# Altium schematic sheet cont_board.SchDoc
size A
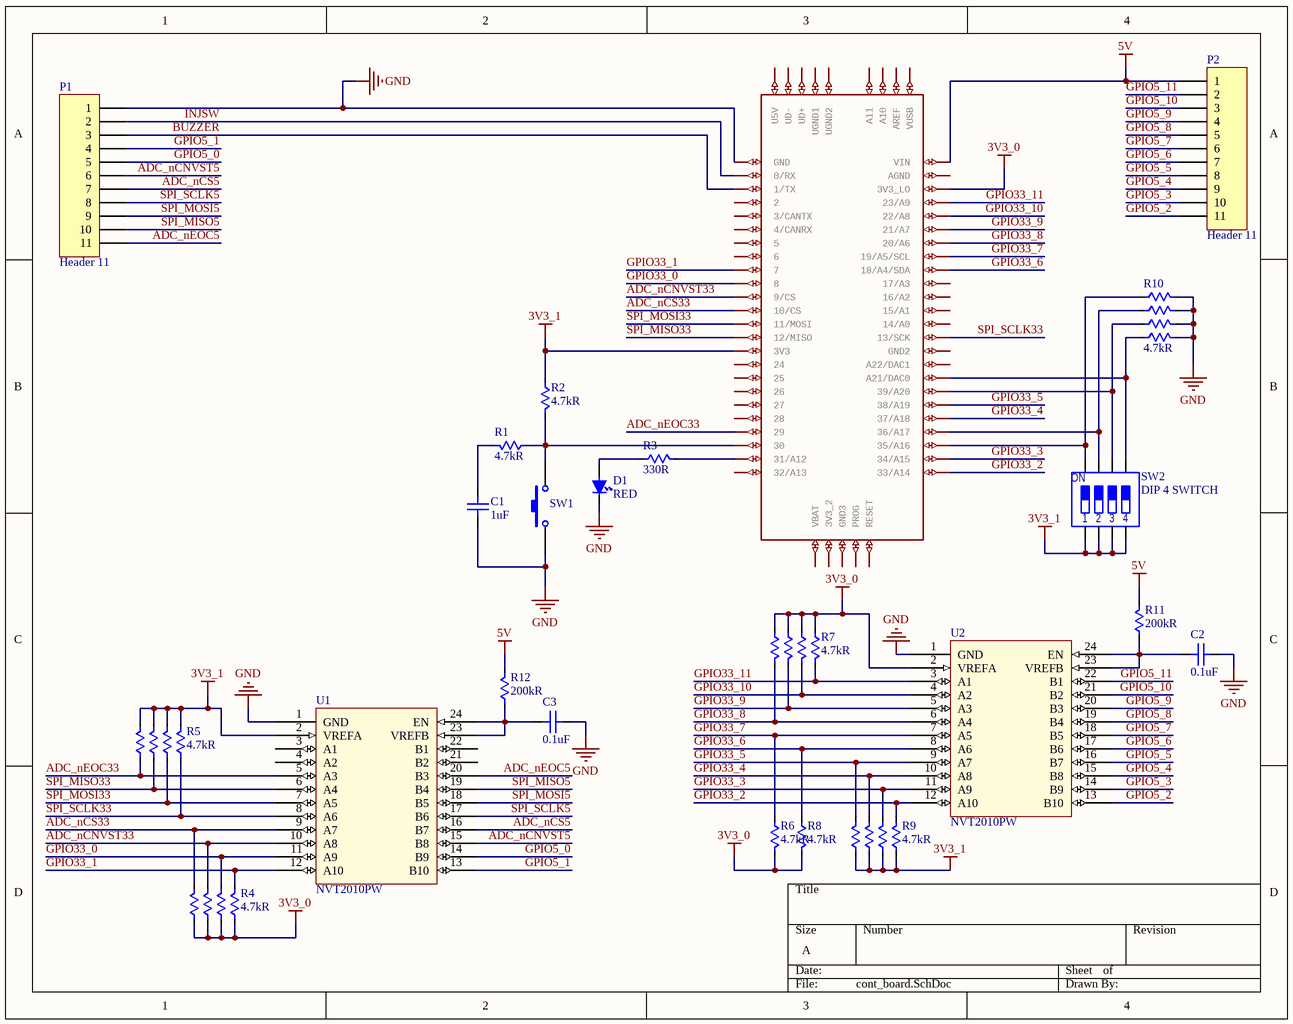
[diagram p0: cont_board.SchDoc]

## Parts
1  TEENSY_3.5/3.6  [TEENSY_3.5/3.6]  (value not drawn)
C1  1uF  [CAP_0805]
C2  0.1uF  [CAP_0805]
C3  0.1uF  [CAP_0805]
D1  RED  [150080SS75000]
P1  Header 11  [HDR1X11]
P2  Header 11  [HDR1X11]
R1  4.7kR  [RES_0805_PANASONIC]
R2  4.7kR  [RES_0805_PANASONIC]
R3  330R  [RES_0805_PANASONIC]
R4  4.7kR  [CAY16-472J4LF]
R5  4.7kR  [CAY16-472J4LF]
R6  4.7kR  [RES_0805_PANASONIC]
R7  4.7kR  [CAY16-472J4LF]
R8  4.7kR  [RES_0805_PANASONIC]
R9  4.7kR  [CAY16-472J4LF]
R10  4.7kR  [CAY16-472J4LF]
R11  200kR  [RES_0805_PANASONIC]
R12  200kR  [RES_0805_PANASONIC]
SW1  B3FS-1000P  [B3FS-1000P]  (value not drawn)
SW2  DIP 4 SWITCH  [DS04-254-2-04BK-SMT-TR]
U1  NVT2010PW  [NVT2010]
U2  NVT2010PW  [NVT2010]

## Nets
3V3_0: 1.3V3_LO R4.1 R4.3 R4.5 R4.7 R6.2 R7.1 R7.3 R7.5 R7.7 R8.2 U2.2(VREFA)
3V3_1: 1.3V3 R2.1 R5.1 R5.3 R5.5 R5.7 R9.1 R9.3 R9.5 R9.7 SW2.5 SW2.6 SW2.7 SW2.8 U1.2(VREFA)
5V: 1.VIN P2.1 R11.2 R12.2
GND: 1.GND C1.1 C2.1 C3.1 D1.1 P1.1 R10.2 R10.4 R10.6 R10.8 SW1.1 U1.1(GND) U2.1(GND)
ADC_nCNVST5: P1.6 U1.15(B8)
ADC_nCNVST33: 1.9/CS R4.6 U1.10(A8)
ADC_nCS5: P1.7 U1.16(B7)
ADC_nCS33: 1.10/CS R4.8 U1.9(A7)
ADC_nEOC5: P1.11 U1.20(B3)
ADC_nEOC33: 1.29 R5.8 U1.5(A3)
BUZZER: 1.1/TX P1.3
GPIO5_0: P1.5 U1.14(B9)
GPIO5_1: P1.4 U1.13(B10)
GPIO5_2: P2.11 U2.13(B10)
GPIO5_3: P2.10 U2.14(B9)
GPIO5_4: P2.9 U2.15(B8)
GPIO5_5: P2.8 U2.16(B7)
GPIO5_6: P2.7 U2.17(B6)
GPIO5_7: P2.6 U2.18(B5)
GPIO5_8: P2.5 U2.19(B4)
GPIO5_9: P2.4 U2.20(B3)
GPIO5_10: P2.3 U2.21(B2)
GPIO5_11: P2.2 U2.22(B1)
GPIO33_0: 1.8 R4.4 U1.11(A9)
GPIO33_1: 1.7 R4.2 U1.12(A10)
GPIO33_2: 1.33/A14 R9.2 U2.12(A10)
GPIO33_3: 1.34/A15 R9.4 U2.11(A9)
GPIO33_4: 1.37/A18 R9.6 U2.10(A8)
GPIO33_5: 1.38/A19 R9.8 U2.9(A7)
GPIO33_6: 1.18/A4/SDA R8.1 U2.8(A6)
GPIO33_7: 1.19/A5/SCL R6.1 U2.7(A5)
GPIO33_8: 1.20/A6 R7.2 U2.6(A4)
GPIO33_9: 1.21/A7 R7.4 U2.5(A3)
GPIO33_10: 1.22/A8 R7.6 U2.4(A2)
GPIO33_11: 1.23/A9 R7.8 U2.3(A1)
INJSW: 1.0/RX P1.2
SPI_MISO5: P1.10 U1.19(B4)
SPI_MISO33: 1.12/MISO R5.6 U1.6(A4)
SPI_MOSI5: P1.9 U1.18(B5)
SPI_MOSI33: 1.11/MOSI R5.4 U1.7(A5)
SPI_SCLK5: P1.8 U1.17(B6)
SPI_SCLK33: 1.13/SCK R5.2 U1.8(A6)
Net1_21/DAC0: 1.21/DAC0(A21/DAC0) R10.1 SW2.4
Net1_30: 1.30 R1.1 R2.2 SW1.2
Net1_31/A12: 1.31/A12 R3.2
Net1_35/A16: 1.35/A16 R10.7 SW2.1
Net1_36/A17: 1.36/A17 R10.5 SW2.2
Net1_39/A20: 1.39/A20 R10.3 SW2.3
NetC1_2: C1.2 R1.2
NetC2_2: C2.2 R11.1 U2.23(VREFB) U2.24(EN)
NetC3_2: C3.2 R12.1 U1.23(VREFB) U1.24(EN)
NetD1_2: D1.2 R3.1

Not connected (* = marked no-connect by the designer): 1 2 3/CANTX 3V3_2 4/CANRX 5 6 14/A0 15/A1 16/A2 17/A3 24 25 26 27 28 32/A13 A10 A11 A22/DAC1 AGND AREF GND2 GND3 PROG RESET U5V UD+ UD- UGND1 UGND2 VBAT VUSB; U1 3(A1) 4(A2) 21(B2) 22(B1)

## Notes on the sheet
- (in symbol DS04-254-2-04BK-SMT-TR) ON

## Library data of the parts
1 = TEENSY_3.5/3.6: GateName_1: G$1; SymbolName_1: TEENSY_3.5/3.6; LibraryName: Teensy356; DeviceSetName: TEENSY_3.5/3.6; Package: TEENSY_3.5/3.6
C1 = C0805C105Z4VACTU: Cap Ceramic 1uF 16V Y5V -20% to 80% Pad SMD 0805 85C T/R; Manufacturer: KEMET; Dissipation Factor: 7%; Supplier 1: Digi-Key; Manufacturer Part Number: C0805C105Z4VACTU; Category: Capacitor; Stock 1: 83211; Pricing 1: 1=0.11000, 10=0.08100, 50=0.04420, 100=0.03620, 500=0.02584, 1000=0.02030 (USD); Mount: Surface Mount; Case/Package: 0805; Number of Pins: 2; Case Code (Metric): 2012; Case Code (Imperial): 0805; Contact Material: Tin; Dielectric Material: Ceramic; Min Operating Temperature: -30°C; Max Operating Temperature: 85°C; Package Quantity: 1; Capacitance: 1uF; Voltage Rating: 16V; Tolerance: 80%; Packaging: Tape and Reel; Voltage Rating (DC): 16V; Dielectric: Y5V; Termination: SMD/SMT; Voltage: 16V; Length: 2mm; Height: 1.25mm; Width: 0.049inch; Thickness: 0.055inch; Lead Pitch: 0.75mm; Depth: 1.25mm; Radiation Hardening: No; REACH SVHC: No SVHC; Lead Free: Lead Free; ComponentLink1URL: https://datasheet.ciiva.com/6074/1698780-6074369.pdf?src-supplier=Farnell; ComponentLink1Description: https://datasheet.ciiva.com/6074/1698780-6074369.pdf?src-supplier=Farnell; ComponentLink2URL: https://datasheet.ciiva.com/16623/datasheetpn-c0805c105z4vac7800-16623623.pdf?src-supplier=Avnet+Europe; ComponentLink2Description: https://datasheet.ciiva.com/16623/datasheetpn-c0805c105z4vac7800-16623623.pdf?src-supplier=Avnet+Europe; ComponentLink3URL: https://datasheet.ciiva.com/14604/70095383-14604106.pdf?src-supplier=Allied+Electronics; ComponentLink3Description: https://datasheet.ciiva.com/14604/70095383-14604106.pdf?src-supplier=Allied+Electronics; ComponentLink4URL: https://datasheet.ciiva.com/7600/1698780-7600029.pdf?src-supplier=Newark; ComponentLink4Description: https://datasheet.ciiva.com/7600/1698780-7600029.pdf?src-supplier=Newark; ComponentLink5URL: https://datasheet.ciiva.com/14589/70095383-14589407.pdf?src-supplier=Allied+Electronics; ComponentLink5Description: https://datasheet.ciiva.com/14589/70095383-14589407.pdf?src-supplier=Allied+Electronics; ComponentLink6URL: http://datasheet.octopart.com/C0805C105Z4VACTU-Kemet-datasheet-13692877.pdf?src-supplier=Element14; ComponentLink6Description: http://datasheet.octopart.com/C0805C105Z4VACTU-Kemet-datasheet-13692877.pdf?src-supplier=Element14; ComponentLink7URL: http://datasheet.octopart.com/C0805C105Z4VACTU-Kemet-datasheet-503297.pdf?src-supplier=Newark; ComponentLink7Description: http://datasheet.octopart.com/C0805C105Z4VACTU-Kemet-datasheet-503297.pdf?src-supplier=Newark; ComponentLink8URL: http://datasheet.octopart.com/C0805C105Z4VACTU-KEMET-datasheet-101576167.pdf?src-supplier=Farnell; ComponentLink8Description: http://datasheet.octopart.com/C0805C105Z4VACTU-KEMET-datasheet-101576167.pdf?src-supplier=Farnell; ComponentLink9URL: http://datasheet.octopart.com/C0805C105Z4VACTU-KEMET-datasheet-83957834.pdf?src-supplier=TME; ComponentLink9Description: http://datasheet.octopart.com/C0805C105Z4VACTU-KEMET-datasheet-83957834.pdf?src-supplier=TME; ComponentLink10URL: http://datasheet.octopart.com/C0805C105Z4VACTU-Kemet-datasheet-5313890.pdf?src-supplier=Verical; ComponentLink10Description: http://datasheet.octopart.com/C0805C105Z4VACTU-Kemet-datasheet-5313890.pdf?src-supplier=Verical; ComponentLink11URL: http://datasheet.octopart.com/C0805C105Z4VAC-TU-Kemet-datasheet-8204015.pdf?src-supplier=Jameco; ComponentLink11Description: http://datasheet.octopart.com/C0805C105Z4VAC-TU-Kemet-datasheet-8204015.pdf?src-supplier=Jameco; ComponentLink12URL: http://datasheet.octopart.com/C0805C105Z4VACTU-Kemet-datasheet-464.pdf?src-supplier=Allied+Electronics; ComponentLink12Description: http://datasheet.octopart.com/C0805C105Z4VACTU-Kemet-datasheet-464.pdf?src-supplier=Allied+Electronics; ComponentLink13URL: http://datasheet.octopart.com/C0805C105Z4VACTU-Kemet-datasheet-11554470.pdf?src-supplier=Arrow; ComponentLink13Description: http://datasheet.octopart.com/C0805C105Z4VACTU-Kemet-datasheet-11554470.pdf?src-supplier=Arrow; ComponentLink14URL: http://datasheet.octopart.com/C0805C105Z4VACTU-Kemet-datasheet-66128697.pdf?src-supplier=Element14; ComponentLink14Description: http://datasheet.octopart.com/C0805C105Z4VACTU-Kemet-datasheet-66128697.pdf?src-supplier=Element14; ComponentLink15URL: http://datasheet.octopart.com/C0805C105Z4VACTU-Kemet-datasheet-66325528.pdf?src-supplier=Newark; ComponentLink15Description: http://datasheet.octopart.com/C0805C105Z4VACTU-Kemet-datasheet-66325528.pdf?src-supplier=Newark; ComponentLink16URL: http://datasheet.octopart.com/C0805C105Z4VACTU-Kemet-datasheet-67847115.pdf?src-supplier=TME; ComponentLink16Description: http://datasheet.octopart.com/C0805C105Z4VACTU-Kemet-datasheet-67847115.pdf?src-supplier=TME; ComponentLink17URL: http://datasheet.octopart.com/C0805C105Z4VACTU-KEMET-datasheet-84169754.pdf; ComponentLink17Description: http://datasheet.octopart.com/C0805C105Z4VACTU-KEMET-datasheet-84169754.pdf; ComponentLink18URL: http://datasheet.octopart.com/C0805C105Z4VACTU-KEMET-datasheet-41193421.pdf?src-supplier=Master+Electronics; ComponentLink18Description: http://datasheet.octopart.com/C0805C105Z4VACTU-KEMET-datasheet-41193421.pdf?src-supplier=Master+Electronics; Supplier Part Number 1: 399-8011-1-ND
C2 C3 = C0805C104M3RACTU: CAP CER 0.1UF 25V X7R 0805; Manufacturer: KEMET; Dielectric Material: Ceramic; Capacitance: 100nF; Tolerance: 20%; Dissipation Factor: 5%; Supplier 1: Digi-Key; RoHS: Yes; Category: Capacitor; Stock 1: 305175; Pricing 1: 1=0.10000, 10=0.06800, 50=0.03700, 100=0.03020, 500=0.02160, 1000=0.01697 (USD); Mount: Surface Mount; Case/Package: 0805; Case Code (Metric): 2012; Case Code (Imperial): 0805; Min Operating Temperature: -55°C; Max Operating Temperature: 125°C; Package Quantity: 1; Voltage Rating: 25V; Packaging: Tape and Reel; Voltage Rating (DC): 25V; Dielectric: X7R; Termination: SMD/SMT; Voltage: 25V; Length: 2mm; Height: 0.9mm; Width: 0.049inch; Thickness: 0.035inch; Lead Pitch: 0.75mm; Depth: 1.25mm; Radiation Hardening: No; REACH SVHC: No SVHC; ComponentLink1URL: http://www.mouser.com/ds/2/212/KEM_C1002_X7R_SMD-1102033.pdf?src-supplier=Mouser; ComponentLink1Description: http://www.mouser.com/ds/2/212/KEM_C1002_X7R_SMD-1102033.pdf?src-supplier=Mouser; ComponentLink2URL: http://uk.rs-online.com/webdocs/13da/0900766b813da9ff.pdf?src-supplier=RSComponents; ComponentLink2Description: http://uk.rs-online.com/webdocs/13da/0900766b813da9ff.pdf?src-supplier=RSComponents; ComponentLink3URL: http://components.arrow.com/part/dataview/0323_00178100?src-supplier=Arrow+Europe; ComponentLink3Description: http://components.arrow.com/part/dataview/0323_00178100?src-supplier=Arrow+Europe; ComponentLink4URL: https://www.alliedelec.com/m/d/6f3b5eb83d09db50ed28bdc730567b33.pdf?src-supplier=Allied+Electronics; ComponentLink4Description: https://www.alliedelec.com/m/d/6f3b5eb83d09db50ed28bdc730567b33.pdf?src-supplier=Allied+Electronics; ComponentLink5URL: http://www.farnell.com/datasheets/2746330.pdf?src-supplier=Farnell; ComponentLink5Description: http://www.farnell.com/datasheets/2746330.pdf?src-supplier=Farnell; ComponentLink6URL: http://www.jameco.com/Jameco/Products/ProdDS/1566487.pdf?src-supplier=Jameco; ComponentLink6Description: http://www.jameco.com/Jameco/Products/ProdDS/1566487.pdf?src-supplier=Jameco; ComponentLink7URL: http://components.arrow.com/part/dataview/2091097S3491315N7429?src-supplier=Arrow+Electronics; ComponentLink7Description: http://components.arrow.com/part/dataview/2091097S3491315N7429?src-supplier=Arrow+Electronics; ComponentLink8URL: https://www.alliedelec.com/m/d/e7aa2b5497e2375e4ffc0e8be19e16e2.pdf?src-supplier=Allied+Electronics; ComponentLink8Description: https://www.alliedelec.com/m/d/e7aa2b5497e2375e4ffc0e8be19e16e2.pdf?src-supplier=Allied+Electronics; ComponentLink9URL: http://uk.rs-online.com/webdocs/13da/0900766b813daa05.pdf?src-supplier=RSComponents; ComponentLink9Description: http://uk.rs-online.com/webdocs/13da/0900766b813daa05.pdf?src-supplier=RSComponents; ComponentLink10URL: http://www.farnell.com/datasheets/2746330.pdf?src-supplier=Element14; ComponentLink10Description: http://www.farnell.com/datasheets/2746330.pdf?src-supplier=Element14; ComponentLink11URL: https://api.kemet.com/component-edge/download/datasheet/C0805C104M3RACTU.pdf?src-supplier=Digi-Key; ComponentLink11Description: https://api.kemet.com/component-edge/download/datasheet/C0805C104M3RACTU.pdf?src-supplier=Digi-Key; ComponentLink12URL: http://www.farnell.com/datasheets/1828800.pdf?src-supplier=Newark; ComponentLink12Description: http://www.farnell.com/datasheets/1828800.pdf?src-supplier=Newark; ComponentLink13URL: http://www.farnell.com/datasheets/2746330.pdf?src-supplier=Newark; ComponentLink13Description: http://www.farnell.com/datasheets/2746330.pdf?src-supplier=Newark; ComponentLink14URL: http://capacitoredge.kemet.com/capedge2/DataSheet?pn=C0805C104M3RACTU&src-supplier=Avnet; ComponentLink14Description: http://capacitoredge.kemet.com/capedge2/DataSheet?pn=C0805C104M3RACTU&src-supplier=Avnet; Manufacturer Part Number: C0805C104M3RACTU; Supplier Part Number 1: 399-8000-1-ND
D1 = 150080SS75000: WURTH ELEKTRONIK   150080SS75000   LED, 0805, SUP RED, 60MCD, 630NM; Manufacturer: Wurth Electronics; Forward Current: 30mA; Forward Voltage: 1.9V; Viewing Angle: 140°; Lens Style: Clear,Rectangular; Test Current: 20mA; Supplier 1: Digi-Key; Manufacturer Part Number: 150080SS75000; RoHS: Yes; Category: LEDs; Stock 1: 6006; Pricing 1: 1=0.18000, 50=0.16500, 100=0.14200, 500=0.12300 (USD); Mount: Surface Mount; Case/Package: 0805; Color: Red; Case Code (Metric): 2012; Case Code (Imperial): 0805; Min Operating Temperature: -40°C; Max Operating Temperature: 85°C; Luminous Intensity: 60mcd; Wavelength: 630nm; Package Quantity: 4000; Packaging: Tape and Reel; Dominant Wavelength: 630nm; Length: 2mm; Height: 0.7mm; Width: 1.25mm; REACH SVHC: Unknown; ComponentLink1URL: https://datasheet.ciiva.com/22656/150080ss75000-22656963.pdf?src-supplier=Element14; ComponentLink1Description: https://datasheet.ciiva.com/22656/150080ss75000-22656963.pdf?src-supplier=Element14; ComponentLink2URL: https://datasheet.ciiva.com/29279/759436-da-01-en-chipled-0805-w-kl-s-rot-150080ss75000-29279211.pdf?src-supplier=Conrad; ComponentLink2Description: https://datasheet.ciiva.com/29279/759436-da-01-en-chipled-0805-w-kl-s-rot-150080ss75000-29279211.pdf?src-supplier=Conrad; ComponentLink3URL: https://datasheet.ciiva.com/29563/150080ss75000-29563014.pdf?src-supplier=Digi-Key; ComponentLink3Description: https://datasheet.ciiva.com/29563/150080ss75000-29563014.pdf?src-supplier=Digi-Key; ComponentLink4URL: https://datasheet.ciiva.com/29563/150080ss75000-29563015.pdf?src-supplier=Digi-Key; ComponentLink4Description: https://datasheet.ciiva.com/29563/150080ss75000-29563015.pdf?src-supplier=Digi-Key; ComponentLink5URL: https://datasheet.ciiva.com/29563/150080ss75000-29563013.pdf?src-supplier=Digi-Key; ComponentLink5Description: https://datasheet.ciiva.com/29563/150080ss75000-29563013.pdf?src-supplier=Digi-Key; Supplier Part Number 1: 732-4985-1-ND
P1 P2 = Header 11: Header, 11-Pin; LatestRevisionDate: 17-Jul-2002; LatestRevisionNote: Re-released for DXP Platform.; Publisher: Altium Limited
R1 R2 R6 R8 = ERA-6AED472V: Res Thin Film 0805 4.7K Ohm 0.5% 0.125W(1/8W) ±25ppm/C Molded SMD Automotive Punched T/R; Manufacturer: Panasonic; Temperature Coefficient: 25ppm/°C; Power Rating: 125mW; Voltage Rating: 100V; Supplier 1: Digi-Key; Manufacturer Part Number: ERA-6AED472V; RoHS: Yes; Category: Chip SMD Resistors; Stock 1: 25343; Pricing 1: 1=0.10000, 10=0.09400, 100=0.03600, 1000=0.01584, 2500=0.01368 (USD); Case/Package: 0805; Case Code (Metric): 2012; Case Code (Imperial): 0805; Min Operating Temperature: -55°C; Max Operating Temperature: 155°C; Package Quantity: 5000; Packaging: Tape and Reel; Resistance: 4.7kR; Tolerance: 0.5%; Length: 2mm; Height: 0.5mm; Width: 1.25mm; Lead Free: Lead Free; ComponentLink1URL: https://datasheet.ciiva.com/24027/aoa0000ce26-32660-24027576.pdf?src-supplier=Mouser; ComponentLink1Description: https://datasheet.ciiva.com/24027/aoa0000ce26-32660-24027576.pdf?src-supplier=Mouser; Supplier Part Number 1: P123914CT-ND; Mount: Surface Mount; Contact Plating: Tin; Resistor Type: Metal Film,Thin Film; Depth: 1.25mm; Military Standard: Not
R3 = ERA-6AED331V: Res Thin Film 0805 330 Ohm 0.5% 0.125W(1/8W) ±25ppm/C Molded SMD Automotive Punched T/R; Manufacturer: Panasonic; Temperature Coefficient: 25ppm/°C; Power Rating: 125mW; Voltage Rating: 200V; Supplier 1: Digi-Key; Manufacturer Part Number: ERA-6AED331V; RoHS: Yes; Category: Resistor; Stock 1: 11862; Pricing 1: 1=0.10000, 10=0.09400, 25=0.06480, 50=0.05040, 100=0.03600, 250=0.02808, 500=0.02232, 1000=0.01584 (USD); Mount: Surface Mount; Case/Package: 0805; Contact Plating: Tin; Case Code (Metric): 2012; Case Code (Imperial): 0805; Min Operating Temperature: -55°C; Max Operating Temperature: 155°C; Termination: SMD/SMT; Resistor Type: Thin Film; Resistance: 330R; Tolerance: 0.5%; Packaging: Tape and Reel; Package Quantity: 5000; Length: 2mm; Height: 0.5mm; Depth: 1.25mm; Width: 1.25mm; Military Standard: Not; Lead Free: Lead Free; ComponentLink1URL: https://datasheet.ciiva.com/24071/aoa0000ce26-197354-24071480.pdf?src-supplier=Mouser; ComponentLink1Description: https://datasheet.ciiva.com/24071/aoa0000ce26-197354-24071480.pdf?src-supplier=Mouser; ComponentLink2URL: https://datasheet.ciiva.com/9182/aoa0000ce26-9182970.pdf?src-supplier=Avnet; ComponentLink2Description: https://datasheet.ciiva.com/9182/aoa0000ce26-9182970.pdf?src-supplier=Avnet; Supplier Part Number 1: P123837CT-ND
R4 R5 R7 R9 R10 = CAY16-472J4LF: RES ARRAY 4 RES 4.7K OHM 1206; Manufacturer: Bourns; Number of Resistors: 4; Voltage Rating (DC): 50V; Circuit Type: Isolated; Power Per Element: 62.5mW; Temperature Coefficient: 200ppm/°C; Tolerance: 5%; Power Rating: 248mW; Supplier 1: Digi-Key; Manufacturer Part Number: CAY16-472J4LF; RoHS: Yes; Category: Resistor; Stock 1: 28152; Pricing 1: 1=0.10000, 10=0.06900, 25=0.04760, 50=0.03720, 100=0.02650, 250=0.02068, 500=0.01644, 1000=0.01166 (USD); Mount: Surface Mount; Case/Package: 1206; Number of Pins: 8; Number of Terminals: 8; Contact Plating: Tin; Case Code (Imperial): 1206; Case Code (Metric): 3216; Min Operating Temperature: -55°C; Max Operating Temperature: 125°C; Resistance: 4.7kR; Number of Circuits: 4; Termination: Convex; Military Standard: Not; Composition: Thick Film; Voltage Rating: 50V; Number of Elements: 4; Packaging: Tape and Reel; Package Quantity: 1; Length: 3.2mm; Height: 0.024inch; Terminal Pitch: 0.8mm; Depth: 1.6mm; Width: 0.063inch; Radiation Hardening: No; REACH SVHC: No SVHC; ComponentLink1URL: https://datasheet.ciiva.com/19466/1979708-19466930.pdf?src-supplier=Jameco; ComponentLink1Description: https://datasheet.ciiva.com/19466/1979708-19466930.pdf?src-supplier=Jameco; ComponentLink2URL: https://datasheet.ciiva.com/11807/0900766b8064e462-11807155.pdf?src-supplier=RSComponents; ComponentLink2Description: https://datasheet.ciiva.com/11807/0900766b8064e462-11807155.pdf?src-supplier=RSComponents; ComponentLink3URL: https://datasheet.ciiva.com/1478/1849489-1478912.pdf?src-supplier=Element14; ComponentLink3Description: https://datasheet.ciiva.com/1478/1849489-1478912.pdf?src-supplier=Element14; ComponentLink4URL: https://datasheet.ciiva.com/25907/catcay-25907158.pdf?src-supplier=Avnet+Europe; ComponentLink4Description: https://datasheet.ciiva.com/25907/catcay-25907158.pdf?src-supplier=Avnet+Europe; ComponentLink5URL: https://datasheet.ciiva.com/30249/catcay-30249688.pdf?src-supplier=Onlinecomponents.com; ComponentLink5Description: https://datasheet.ciiva.com/30249/catcay-30249688.pdf?src-supplier=Onlinecomponents.com; ComponentLink6URL: https://datasheet.ciiva.com/6494/catcay-6494015.pdf?src-supplier=Digi-Key; ComponentLink6Description: https://datasheet.ciiva.com/6494/catcay-6494015.pdf?src-supplier=Digi-Key; ComponentLink7URL: https://datasheet.ciiva.com/3264/catcay-3264889.pdf?src-supplier=Avnet; ComponentLink7Description: https://datasheet.ciiva.com/3264/catcay-3264889.pdf?src-supplier=Avnet; ComponentLink8URL: https://datasheet.ciiva.com/3263/catcay-3263770.pdf?src-supplier=Avnet; ComponentLink8Description: https://datasheet.ciiva.com/3263/catcay-3263770.pdf?src-supplier=Avnet; ComponentLink9URL: https://datasheet.ciiva.com/1478/1849489-1478911.pdf?src-supplier=Element14; ComponentLink9Description: https://datasheet.ciiva.com/1478/1849489-1478911.pdf?src-supplier=Element14; Supplier Part Number 1: CAY16-472J4LFCT-ND
R11 R12 = CRCW0805200KJNEA: VISHAY         CRCW0805200KJNEA             RES, THICK FILM, 200K, 5%, 0.125W, 0805; Manufacturer: Vishay Dale; Power Rating: 125mW; Temperature Coefficient: 200ppm/°C; Voltage Rating: 150V; Supplier 1: Digi-Key; Manufacturer Part Number: CRCW0805200KJNEA; RoHS: Yes; Category: Chip SMD Resistors; Stock 1: 6536; Pricing 1: 1=0.10000, 10=0.05000, 100=0.02040, 1000=0.00914, 2500=0.00794 (USD); Case/Package: 0805; Weight: 0.000194oz; Case Code (Imperial): 0805; Case Code (Metric): 2012; Contact Plating: Tin; Min Operating Temperature: -55°C; Max Operating Temperature: 155°C; Resistance: 200kR; Tolerance: 5%; Packaging: Tape and Reel; Package Quantity: 5000; Termination: SMD/SMT; Resistor Type: Thick Film; Number of Terminations: 2; Max Power Dissipation: 125mW; Features: Automotive AEC-Q200; Series: CRCW; Voltage Rating (DC): 150V; Working Voltage: 150V; Technology: THICK FILM; Construction: Rectangular; Resistance Tolerance: 5%; Length: 2mm; Width: 1.25mm; Height: 0.02inch; Depth: 1.25mm; Radiation Hardening: No; Lead Free: Lead Free; RoHS Compliant: Yes; REACH SVHC: Unknown; Military Standard: Not; ComponentLink1URL: https://datasheet.ciiva.com/3258/dcrcwe3-3258301.pdf?src-supplier=Avnet; ComponentLink1Description: https://datasheet.ciiva.com/3258/dcrcwe3-3258301.pdf?src-supplier=Avnet; ComponentLink2URL: https://datasheet.ciiva.com/2464/dcrcwe3-2464324.pdf?src-supplier=Digi-Key; ComponentLink2Description: https://datasheet.ciiva.com/2464/dcrcwe3-2464324.pdf?src-supplier=Digi-Key; ComponentLink3URL: https://datasheet.ciiva.com/2464/dcrcwe3-2464325.pdf?src-supplier=Digi-Key; ComponentLink3Description: https://datasheet.ciiva.com/2464/dcrcwe3-2464325.pdf?src-supplier=Digi-Key; ComponentLink4URL: https://datasheet.ciiva.com/2464/dcrcwe3-2464326.pdf?src-supplier=Digi-Key; ComponentLink4Description: https://datasheet.ciiva.com/2464/dcrcwe3-2464326.pdf?src-supplier=Digi-Key; ComponentLink5URL: https://datasheet.ciiva.com/16199/dcrcwe3-16199560.pdf?src-supplier=Future+Electronics; ComponentLink5Description: https://datasheet.ciiva.com/16199/dcrcwe3-16199560.pdf?src-supplier=Future+Electronics; ComponentLink6URL: https://datasheet.ciiva.com/22870/70201119-22870413.pdf?src-supplier=Allied+Electronics; ComponentLink6Description: https://datasheet.ciiva.com/22870/70201119-22870413.pdf?src-supplier=Allied+Electronics; ComponentLink7URL: https://datasheet.ciiva.com/16786/70201119-16786315.pdf?src-supplier=Allied+Electronics; ComponentLink7Description: https://datasheet.ciiva.com/16786/70201119-16786315.pdf?src-supplier=Allied+Electronics; Supplier Part Number 1: 541-200KACT-ND
SW1 = B3FS-1000P: OMRON - B3FS1000P - SWITCH, FLAT, 6X6X3.1, 100GF; Mechanical Life: 1000000Cycles; Throw Configuration: SPST; Current Rating: 50mA; Operating Force: 0.98N; Voltage Rating (DC): 24V; Contact Resistance: 100mR; Illumination Type: Non-Illuminated,Illuminated; Number of Poles: 1; Switch Travel: 0.25mm; Switch Function: Off-Mom; Actuator Type: Standard; Actuator Length: 0.5mm; Supplier 1: Digi-Key; Manufacturer: Omron; Manufacturer Part Number: B3FS-1000P; RoHS: Yes; Category: Switch; Stock 1: 62498; Pricing 1: 1=0.59000, 10=0.57000, 25=0.54880, 100=0.47500, 250=0.43276, 500=0.40110, 1000=0.35887 (USD); Mount: Surface Mount; Case/Package: SMD/SMT; Weight: 0.2g; Contact Plating: Silver; Contact Material: Silver; Material: Plastic; Min Operating Temperature: -25°C; Max Operating Temperature: 70°C; Package Quantity: 1; Packaging: Tape and Reel; Contact Current Rating: 50mA; Max Current Rating: 50mA; Max Voltage Rating (DC): 24V; Termination: Gull Wing; Electrical Life: 1000000Cycles; Orientation: Straight; Length: 6.3mm; Depth: 8mm; REACH SVHC: Unknown; Lead Free: Lead Free; ComponentLink1URL: https://datasheet.ciiva.com/2899/en-b3fs-2899744.pdf?src-supplier=Digi-Key; ComponentLink1Description: https://datasheet.ciiva.com/2899/en-b3fs-2899744.pdf?src-supplier=Digi-Key; ComponentLink2URL: https://datasheet.ciiva.com/2899/en-b3fs-2899745.pdf?src-supplier=Digi-Key; ComponentLink2Description: https://datasheet.ciiva.com/2899/en-b3fs-2899745.pdf?src-supplier=Digi-Key; ComponentLink3URL: https://datasheet.ciiva.com/2899/en-b3fs-2899746.pdf?src-supplier=Digi-Key; ComponentLink3Description: https://datasheet.ciiva.com/2899/en-b3fs-2899746.pdf?src-supplier=Digi-Key; ComponentLink4URL: https://datasheet.ciiva.com/1532/en-b3fs-1532627.pdf?src-supplier=Element14; ComponentLink4Description: https://datasheet.ciiva.com/1532/en-b3fs-1532627.pdf?src-supplier=Element14; ComponentLink5URL: https://datasheet.ciiva.com/26827/getdatasheetpartid-131603-26827237.pdf?src-supplier=Verical; ComponentLink5Description: https://datasheet.ciiva.com/26827/getdatasheetpartid-131603-26827237.pdf?src-supplier=Verical; ComponentLink6URL: https://datasheet.ciiva.com/16154/en-b3fs-16154936.pdf?src-supplier=Onlinecomponents.com; ComponentLink6Description: https://datasheet.ciiva.com/16154/en-b3fs-16154936.pdf?src-supplier=Onlinecomponents.com; ComponentLink7URL: https://datasheet.ciiva.com/30214/b3fs-0714-30214221.pdf?src-supplier=Onlinecomponents.com; ComponentLink7Description: https://datasheet.ciiva.com/30214/b3fs-0714-30214221.pdf?src-supplier=Onlinecomponents.com; Supplier Part Number 1: SW423CT-ND
SW2 = DS04-254-2-04BK-SMT-TR: Manufacturer: CUI; Supplier 1: Digi-Key; Manufacturer Part Number: DS04-254-2-04BK-SMT-TR; RoHS: Yes; Stock 1: 183; Pricing 1: 1=0.66000, 10=0.63400, 25=0.61120, 100=0.52880, 250=0.48176 (USD); Supplier Part Number 1: 2223-DS04-254-2-04BK-SMT-CT-ND
U1 U2 = NVT2010PW: 10 pin Bidirectional Level Shifter IC; Manufacturer: NXP Semiconductors; Manufacturer Part Number: NVT2010PW,118; Max Supply Voltage: 5.5V; Min Supply Voltage: 1V; Number of Channels: 10; Propagation Delay: 1.5ns; Logic Function: Translator; Output Type: Voltage; Supplier 1: Digi-Key; RoHS: Yes; Category: Interface ICs; Stock 1: 743; Pricing 1: 1=0.97000, 10=0.86400, 25=0.82000, 100=0.67370, 250=0.62972, 500=0.61508 (USD); Mount: Surface Mount; Case/Package: TSSOP; Number of Pins: 24; Min Operating Temperature: -40°C; Max Operating Temperature: 85°C; Packaging: Tape and Reel; Package Quantity: 1; Number of Bits: 10; Turn-On Delay Time: 1.5ns; Series: -; Radiation Hardening: No; RoHS Compliant: Yes; Lead Free: Lead Free; ComponentLink1URL: https://datasheet.ciiva.com/1899/nvt2008-nvt2010-1899186.pdf?src-supplier=Digi-Key; ComponentLink1Description: https://datasheet.ciiva.com/1899/nvt2008-nvt2010-1899186.pdf?src-supplier=Digi-Key; ComponentLink2URL: https://datasheet.ciiva.com/1899/nvt2008-nvt2010-1899187.pdf?src-supplier=Digi-Key; ComponentLink2Description: https://datasheet.ciiva.com/1899/nvt2008-nvt2010-1899187.pdf?src-supplier=Digi-Key; ComponentLink3URL: https://datasheet.ciiva.com/8244/nvt2008-nvt2010-8244294.pdf?src-supplier=Avnet; ComponentLink3Description: https://datasheet.ciiva.com/8244/nvt2008-nvt2010-8244294.pdf?src-supplier=Avnet; ComponentLink4URL: https://datasheet.ciiva.com/1899/nvt2008-nvt2010-1899185.pdf?src-supplier=Digi-Key; ComponentLink4Description: https://datasheet.ciiva.com/1899/nvt2008-nvt2010-1899185.pdf?src-supplier=Digi-Key; Supplier Part Number 1: 568-5299-1-ND